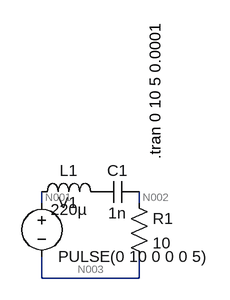
[diagram p0: schematic SimulacijaLC.asc]
SimulacijaLC.asc, the LTspice schematic file:
Version 4.1
SHEET 1 880 680
WIRE 64 64 64 48
WIRE 208 64 208 48
WIRE 64 176 64 144
WIRE 208 176 208 144
WIRE 208 176 64 176
SYMBOL ind 48 64 R270
WINDOW 0 32 56 VTop 2
WINDOW 3 5 56 VBottom 2
SYMATTR InstName L1
SYMATTR Value 220µ
SYMBOL res 192 48 R0
SYMATTR InstName R1
SYMATTR Value 10
SYMBOL cap 208 32 R90
WINDOW 0 0 32 VBottom 2
WINDOW 3 32 32 VTop 2
SYMATTR InstName C1
SYMATTR Value 1n
SYMBOL voltage 64 48 R0
WINDOW 123 0 0 Left 0
WINDOW 39 0 0 Left 0
SYMATTR InstName V1
SYMATTR Value PULSE(0 10 0 0 0 5)
TEXT 232 0 VLeft 2 !.tran 0 10 5 0.0001

The netlist it stands for:
* SimulacijaLC.asc
L1 N001 P001 220µ
R1 N002 N003 10
C1 N002 P001 1n
V1 N001 N003 PULSE(0 10 0 0 0 5)
.tran 0 10 5 0.0001
.backanno
.end

* Results of the author's LTspice run, read from the files saved beside the schematic
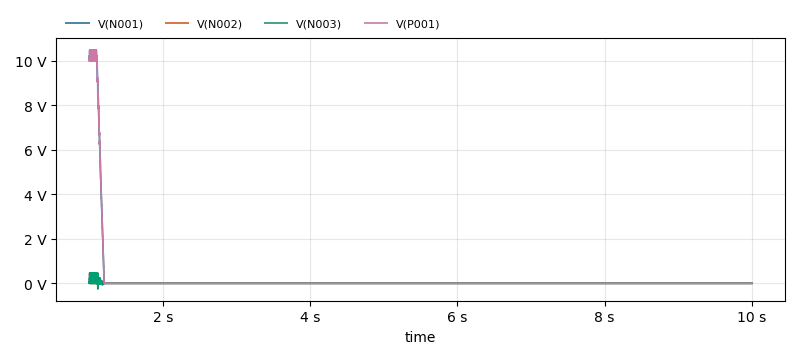
[diagram p1: Transient Analysis of SimulacijaLC.asc, plotted from the saved traces]
* Transient Analysis, 1 run:
*   V(N001): min 0 V, max 10.47 V, average 169.2 mV, rms 1.236 V, last 0 V
*   V(N002): min -246 mV, max 465.7 mV, average 2.5 mV, rms 29.73 mV, last 0 V
*   V(N003): min -246 mV, max 465.7 mV, average 2.5 mV, rms 29.73 mV, last 0 V
*   V(P001): min 0 V, max 10.47 V, average 169.2 mV, rms 1.236 V, last 0 V